# EAGLE design adapter (EAGLE 9.6.2)
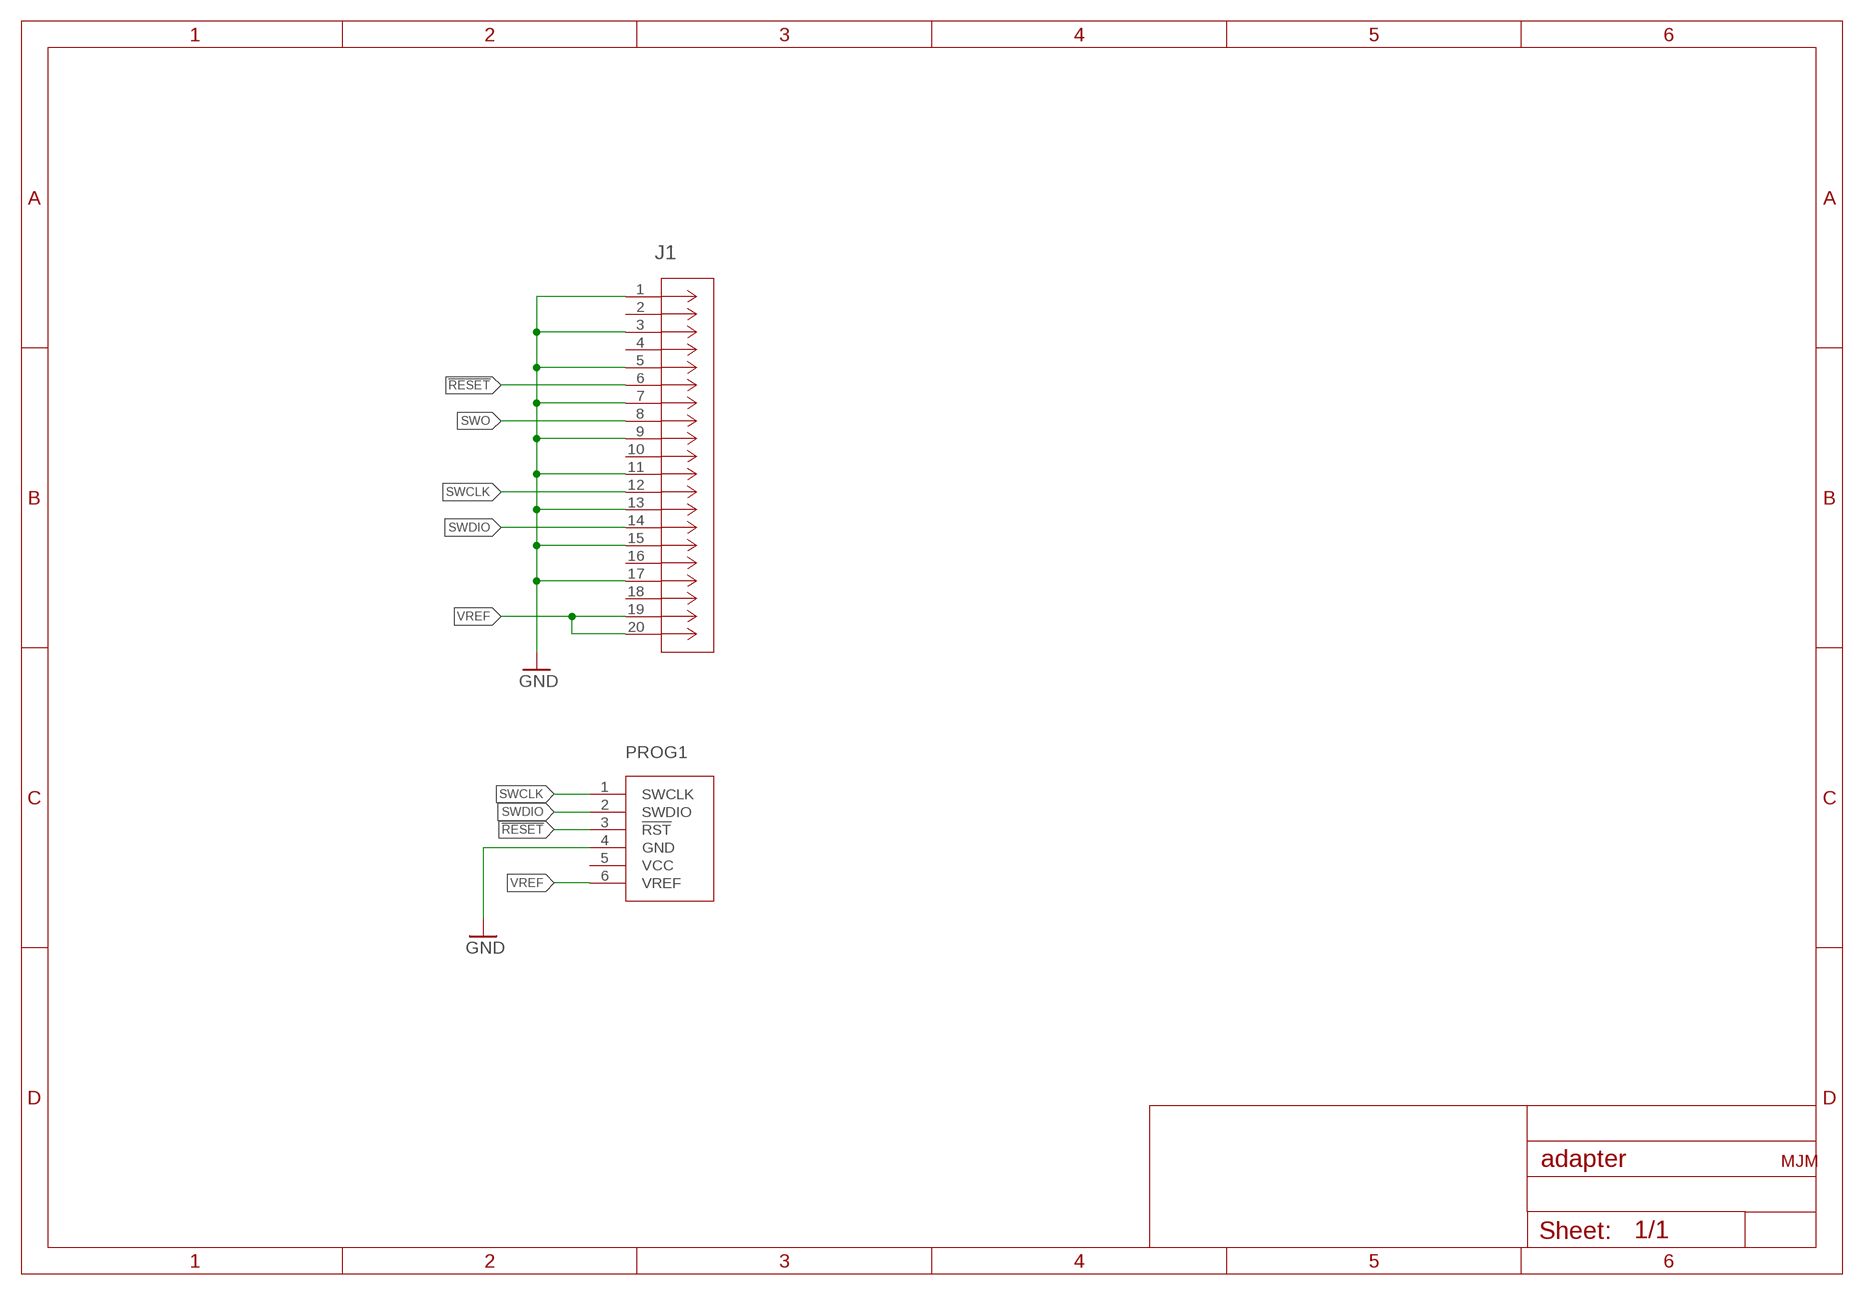
[diagram p0: schematic, sheet 1]

## Parts
J1  SFH11-PBPC-D10-ST-BK  [CONN_SFH11-PBPC-D10-ST-BK_SUL]
PROG1  0532610671_OP  [0532610671]

## Nets
!RESET: J1.6 PROG1.3(!RST)
GND: J1.1 J1.3 J1.5 J1.7 J1.9 J1.11 J1.13 J1.15 J1.17 PROG1.4(GND)
SWCLK: J1.12 PROG1.1(SWCLK)
SWDIO: J1.14 PROG1.2(SWDIO)
SWO: J1.8
VREF: J1.19 J1.20 PROG1.6(VREF)
Unconnected: J1.2 J1.4 J1.10 J1.16 J1.18 PROG1.5(VCC)

## Notes on the sheet
- MJM

## Library data of the parts
J1 = STM32_SFH11-PBPC-D10-ST-BK_:SFH11-PBPC-D10-ST-BK; BUILT_BY: EMA_Cory; COPYRIGHT: Copyright (C) 2018 Accelerated Designs. All rights reserved; DATASHEET: https://s3.amazonaws.com/catalogspreads-pdf/PAGE123%20.100%20SFH11%20SERIES%20FEMALE%20HDR%20ST%20RA.pdf; MANUFACTURER_PART_NUMBER: SFH11-PBPC-D10-ST-BK; SOURCELIBRARY: Update_to_database_2021-05-10; VENDOR: Sullins
PROG1 = 0532610671:0532610671_OP

## Board
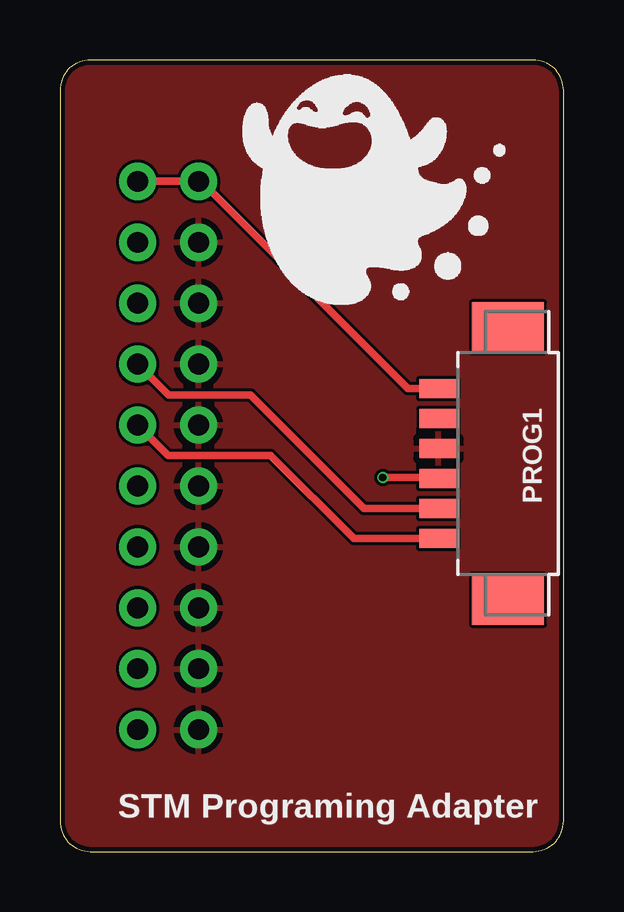
[diagram p1: board, top side]
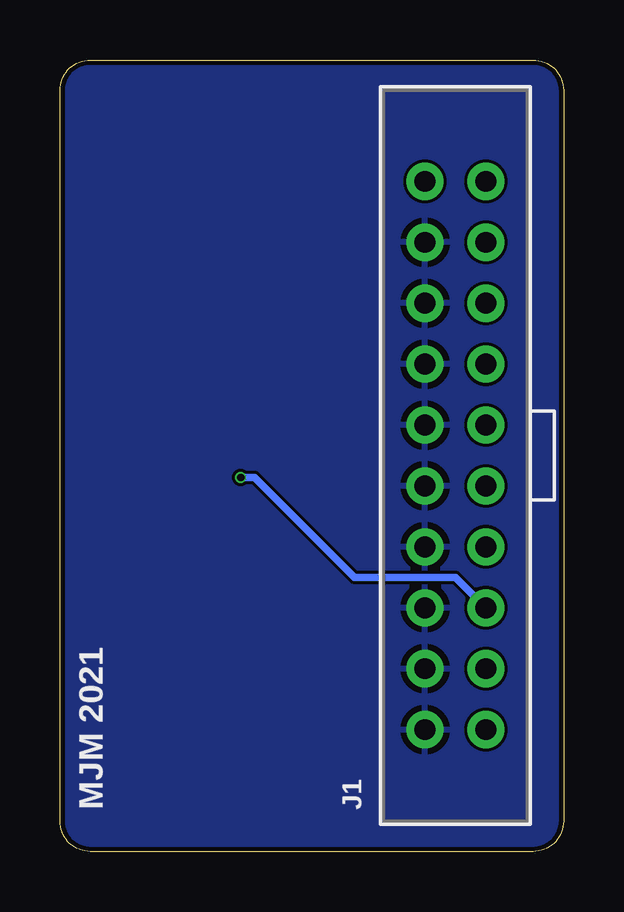
[diagram p2: board, bottom side, seen from below]

Size 21 x 33 mm. Coordinates in mm from the lower left corner, seen from the top.
Outline: 0,31.73 0,1.27 arc90 1.27,0 19.73,0 arc90 21,1.27 21,31.73 arc90 19.73,33 1.27,33 arc90 0,31.73
Copper layers (1*16): Top 0.035mm / dielectric 1.6mm / Bottom 0.035mm
Design rules "jlcpcb-2layers_tinted_vias": minimum track width 5mil, minimum drill 0.3mm, track to track 5mil, track to pad 5mil, pad to pad 5mil, via to via 5mil, smd to smd 5mil, copper to edge 0.2mm, drill to drill 6mil, minimum pad ring 10mil, minimum via ring 3mil, stop-mask expansion 4mil, vias tented up to drill 20mil, thermal gap 10mil

### Footprints (pad centres in the part's own frame; a part is rotated, then mirrored left to right if it is on the bottom)
CONN_SFH11-PBPC-D10-ST-BK_SUL = drill 0.864 pad 1.372: 1 0,0; 2 0,-2.54; 3 2.54,0; 4 2.54,-2.54; 5 5.08,0; 6 5.08,-2.54; 7 7.62,0; 8 7.62,-2.54; 9 10.16,0; 10 10.16,-2.54; 11 12.7,0; 12 12.7,-2.54; 13 15.24,0; 14 15.24,-2.54; 15 17.78,0; 16 17.78,-2.54; 17 20.32,0; 18 20.32,-2.54; 19 22.86,0; 20 22.86,-2.54
0532610671 = smd 0.8 x 1.6: 1 -3.125,0.8; 2 -1.875,0.8; 3 -0.625,0.8; 4 0.625,0.8; 5 1.875,0.8; 6 3.125,0.8 | smd 2.1 x 3: 7 -5.675,-2.1; 8 5.67,-2.1

### Placement (x,y rotation side)
J1  5.78,5.08 90 bottom
PROG1  16.59,16.18 90 top
U$1  [GHOST]  7.44,22.71 0 top

### Tracks (layer width: path | path; a pad name or v marks a point on that pad's centre or on a via)
!RESET  (via drill 0.3)
  Top 0.305: v13.46,15.6 15.74,15.6 PROG1.3
  Bottom 0.305: J1.6 4.51,11.43 8.71,11.43 12.88,15.6 v13.46,15.6
GND
  pour Top: -0.25,33.27 21.46,33.27 21.46,-0.64 -0.25,-0.64
  pour Bottom: -0.25,33.27 21.46,33.27 21.46,-0.64 -0.25,-0.64
SWCLK
  Top 0.305: J1.12 4.5,16.52 8.79,16.52 12.26,13.05 PROG1.1
SWDIO
  Top 0.305: J1.14 4.53,19.04 7.95,19.04 12.68,14.3 PROG1.2
VREF
  Top 0.305: PROG1.6 14.52,19.3 5.88,27.94 J1.19 J1.20

### Text on the board
tPlace: STM Programing Adapter
bPlace: MJM 2021